# Altium schematic sheet LPF.SchDoc
size A3; SheetNumber: 1; SheetTotal: 4
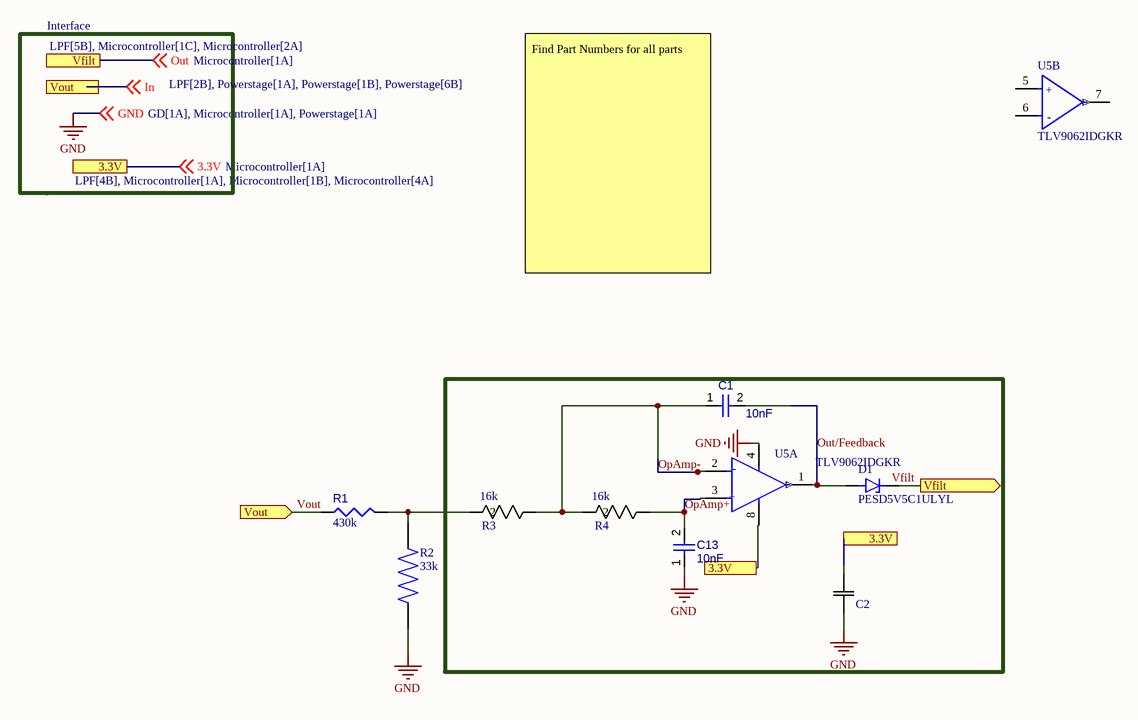
[diagram p0: LPF.SchDoc]

## Parts
C1  10nF  [WCAP-CSMH_0805_L2W1.25H1.25]
C2  TMCP1D105MTRF  [CAP_TMCHPTMCP_VIS]  (value not drawn)
C13  10nF  [WCAP-CSMH_0805_L2W1.25H1.25]
D1  PESD5V5C1ULYL  [DIO_PESD5V5C1ULYL]
R1  value 430k  [RESC2013X60X40LL20T25]  (hidden comment: ERA-6AEB434V)
R2  value 33k  [RESC2012X65N]  (hidden comment: RNCF0805DTE33K0)
R3  16k  [RC0805N_YAG]
R4  16k  [RC0805N_YAG]
U5  TLV9062IDGKR  [FP-DGK0008A-IPC_A]  (parts A,B of 2)

## Ports
3.3V (see LPF[1A], LPF[4B], Microcontroller[1A], Microcontroller[1B], Microcontroller[4A]), 3.3V (see LPF[4B], Microcontroller[1A], Microcontroller[1B], Microcontroller[4A]), Vfilt (out, see LPF[1A], Microcontroller[1C], Microcontroller[2A]), Vfilt (see LPF[5B], Microcontroller[1C], Microcontroller[2A]), Vout (in, see LPF[1A], Powerstage[1A], Powerstage[1B], Powerstage[6B]), Vout (in, see LPF[2B], Powerstage[1A], Powerstage[1B], Powerstage[6B])

## Nets
GND: C2.1 C13.1 R2.1 U5.4(V-) ; off-sheet GND
3.3V: C2.2 U5.8(V+) ; off-sheet 3.3V, port 3.3V
OpAmp+: C13.2 R4.1 U5.3(IN1+)
OpAmp-: C1.1 R3.1 R4.2 U5.2(IN1-)
Out: D1.K ; off-sheet Out, port Vfilt
Out/Feedback: C1.2 D1.A U5.1(OUT1)
Vout: R1.1 ; off-sheet In, port Vout  [also labelled In]
NetR1_2: R1.2 R2.2 R3.2

Not connected (* = marked no-connect by the designer): U5 5(IN2+) 6(IN2-) 7(OUT2)

## Notes on the sheet
- Interface
- Find Part Numbers for all parts
- Labels drawn without touching a wire or pin: Vfilt
- (in symbol CMP-014-00008-1, part A) -; +
- (in symbol CMP-014-00008-1, part B) +; -

## Library data of the parts
C1 C13 = CMP-001-00106-1: Ceramic Capacitor, Multilayer, Ceramic, 500V, 10% +Tol, 10% -Tol, X7R, 15% TC, 0.01uF, Surface Mount, 0805. 885342207014
C2 = CMP-001-00110-1: No Description Available; Mfr_Name: Vishay; Design Item ID: TMCP1D105MTRF; Source: TMCP1D105MTRF.SchLib
D1 = CMP-004-00045-1: Esd Protection Device, 5.5V, Dfn1006 Rohs Compliant: Yes; MF: Nexperia USA Inc.; MP: PESD5V5C1ULYL; SnapEDA_Link: https://www.snapeda.com/parts/PESD5V5C1ULYL/Nexperia/view-part/?ref=snap; Check_prices: https://www.snapeda.com/parts/PESD5V5C1ULYL/Nexperia/view-part/?ref=eda; Value: *; Component Type: Standard; Design Item ID: PESD5V5C1ULYL; Pins: 2; Case/Package: SOD-882 Nexperia USA; Source: PESD5V5C1ULYL.SchLib
R1 = CMP-009-00255-1: Fixed Resistor, Thin Film, 0.125W, 430000ohm, 100V, 0.1% +/-Tol, 25ppm/Cel, Surface Mount, 0805; Power: 125mW; Max Operating Temperature: 155°C; Case/Package: 0805; Tolerance: 0.1%; JESD-609 Code: e3; RoHS Compliant: Yes; Min Operating Temperature: -55°C; Mounting Technology: Surface Mount; Construction: Rectangular; Pins: 2
R2 = CMP-009-00254-1: Pins: 2; Price: None; MP: RNCF0805DTE33K0; Availability: Unavailable; Case/Package: None; Component Type: Standard; Design Item ID: RNCF0805DTE33K0; Source: RNCF0805DTE33K0.SchLib
R3 R4 = CMP-009-00253-1: RC0805FR-0716KL; Mfr_Name: Yageo; Source: RC0805FR-0716KL.SchLib; Design Item ID: RC0805FR-0716KL
U5 = CMP-014-00008-1: Operational Amplifier, 2 Func, 1600uV Offset-Max, CMOS, PDSO8; Supply Voltage Limit-Max: 6V; Common-mode Reject Ratio-Nom: 103dB; Unity Gain BW-Nom: 10MHz; Nominal Supply Voltage: 5V; Channels: 2; Slew Rate: 6.5V/µs; Input Offset Voltage-Max: 2mV; Package Body Material: Plastic; Package Style: SMALL OUTLINE, THIN PROFILE, SHRINK PITCHMeter; Terminal Pitch: 0.65mm; RoHS Compliant: Yes; Width: 3mm; Pins: 8; Length: 3mm; Case/Package: TSSOP; Temperature Grade: AUTOMOTIVE; Terminal Position: DUAL; Surface Mount: Yes; Terminal Form: Gull Wing; Max Operating Temperature: 125°C; Moisture Sensitivity Level: 2; JESD-30 Code: S-PDSO-G8; Min Operating Temperature: -40°C; Height - Seated (Max): 1.1mm; Amplifier Type: OPERATIONAL AMPLIFIER; Technology: CMOS; Package Shape: Square; Reach SVHC Compliant: Yes